# Altium schematic sheet Wedka_schemat.SchDoc
size A3; SheetNumber: 1; SheetTotal: 1
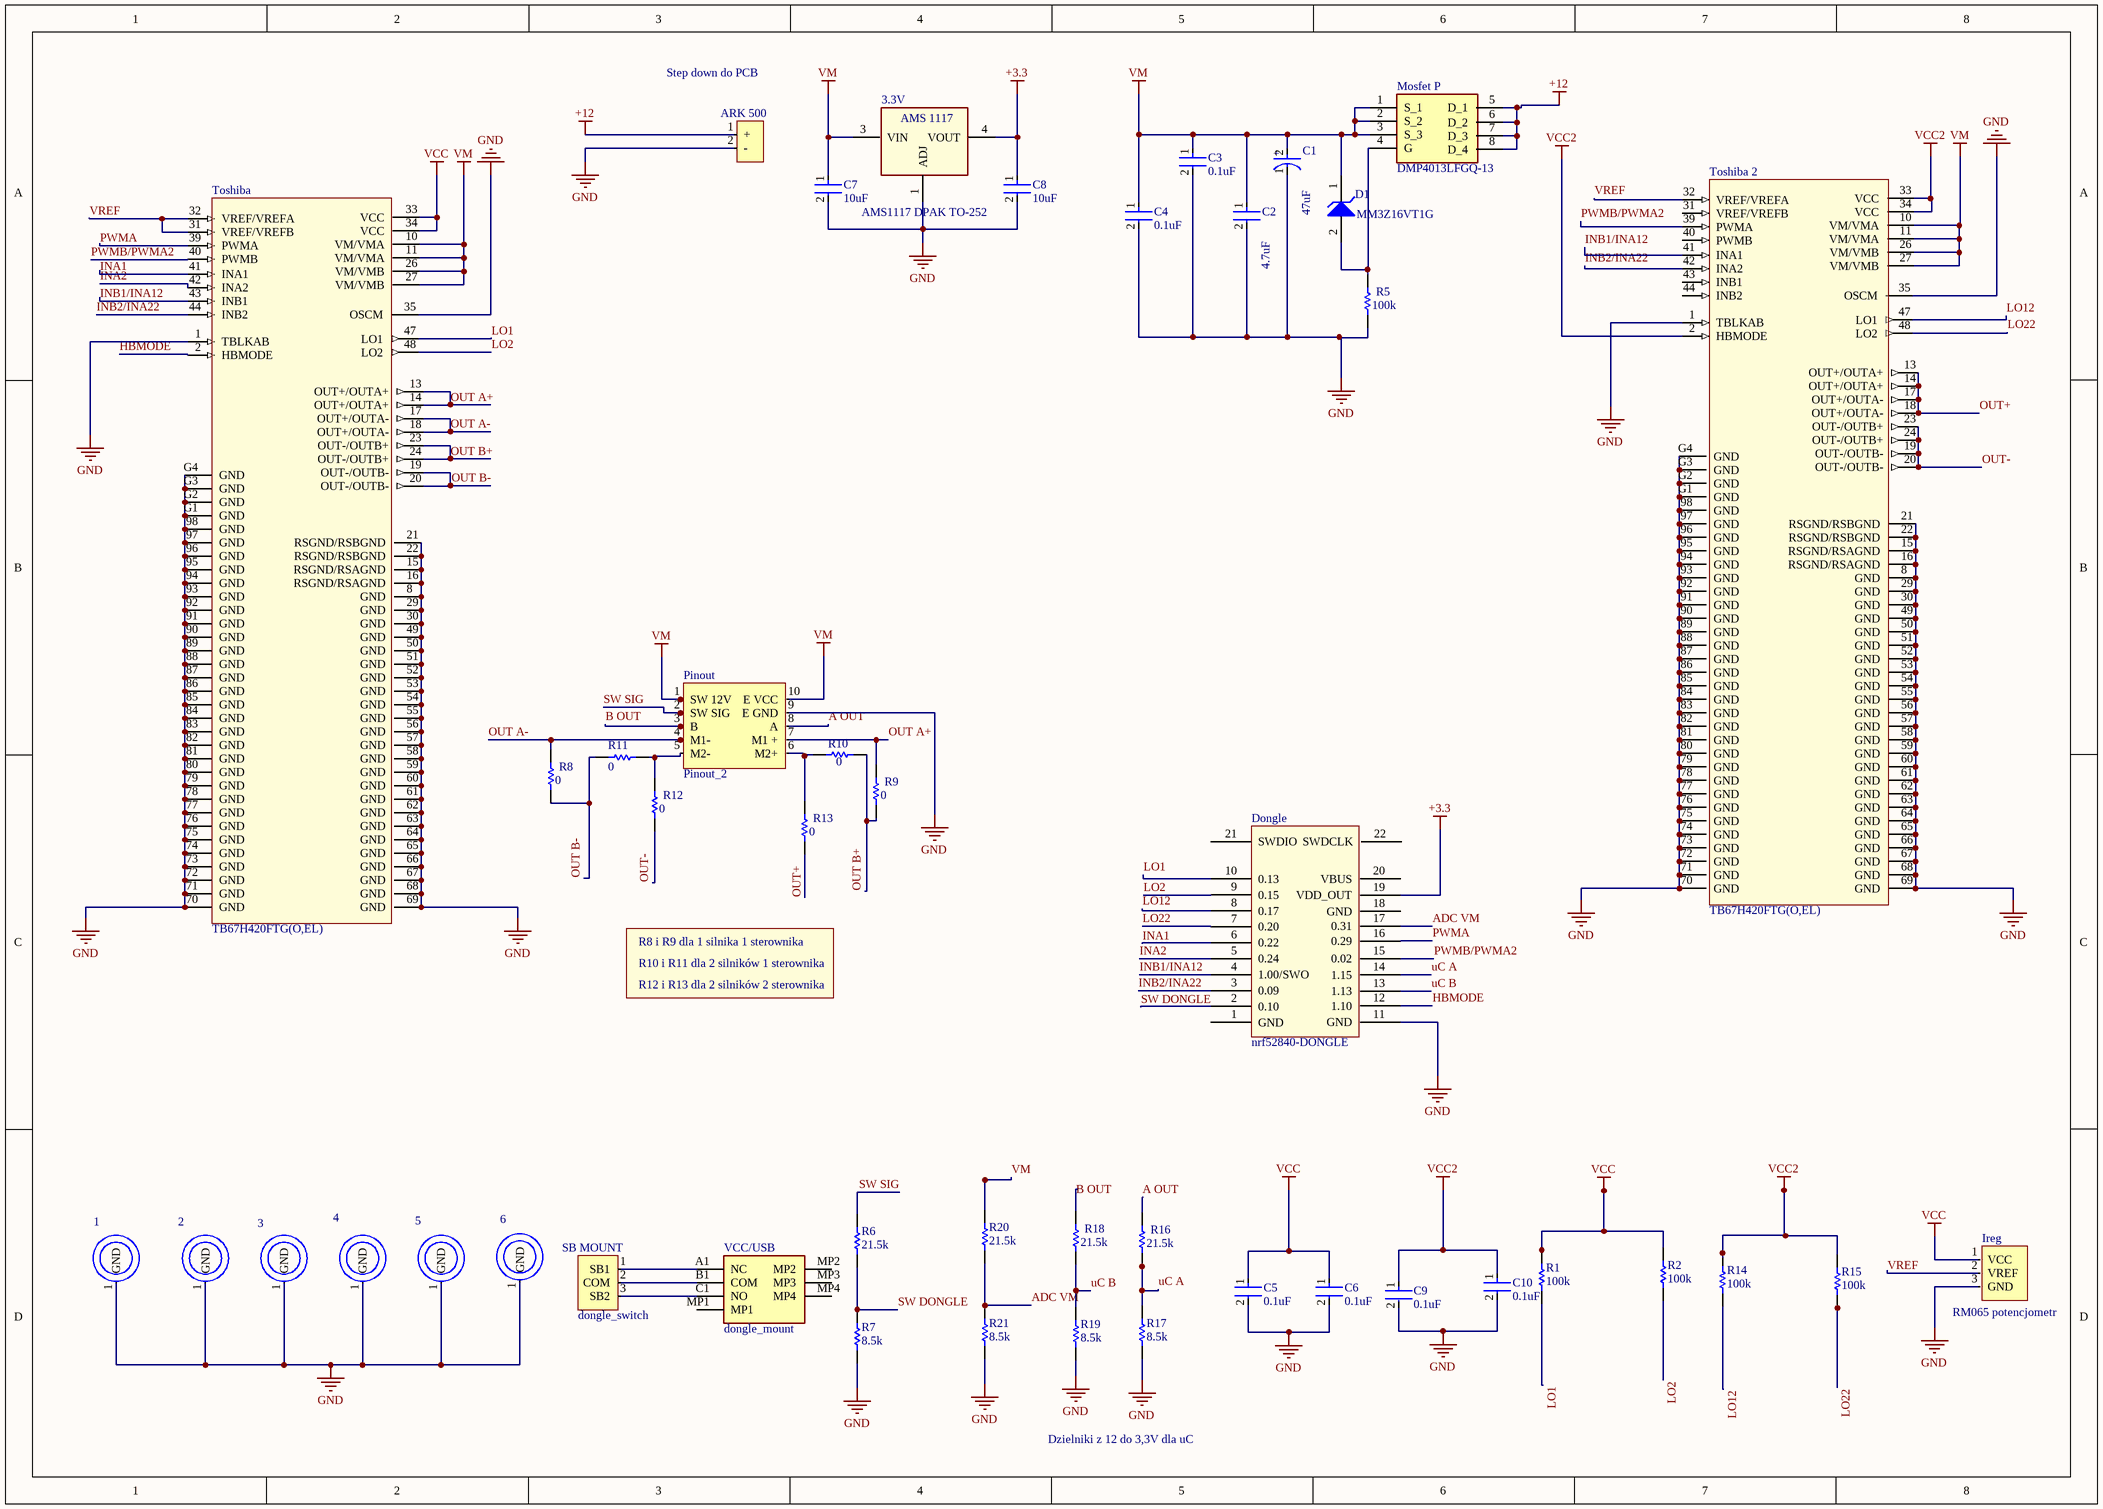
[diagram p0: Wedka_schemat.SchDoc]

## Parts
(Parts that share a designator on the sheet are numbered #1, #2 ... from top to bottom, then left to right.)
3.3V  AMS1117 DPAK TO-252  [AMS1117CD]
?#1  ARK 500  [AK 500]
?#2  6  [PTH]
?#3  1  [PTH]
?#4  2  [PTH]
?#5  3  [PTH]
?#6  4  [PTH]
?#7  5  [PTH]
C1  47uF  [FP-FTD-MFG]
C2  4.7uF  [FP-C0805C475K3PACTU-MFG]
C3  0.1uF  [FP-C0805C104M5UACTU-MFG]
C4  0.1uF  [FP-C0805C104M5UACTU-MFG]
C5  0.1uF  [FP-C0805C104M5UACTU-MFG]
C6  0.1uF  [FP-C0805C104M5UACTU-MFG]
C7  10uF  [FP-GRM21B-0_1-IPC_C]
C8  10uF  [FP-GRM21B-0_1-IPC_C]
C9  0.1uF  [FP-C0805C104M5UACTU-MFG]
C10  0.1uF  [FP-C0805C104M5UACTU-MFG]
D1  MM3Z16VT1G  [ONSC-SOD-323-2-477-02_V]
Dongle  nrf52840-DONGLE  [nrf52840]
Ireg  RM065 potencjometr  [Potenciometer]
Mosfet_P  DMP4013LFGQ-13  [DMP4013LFGQ-13]
Pinout  Pinout_2  [Pinout_2]
R1  100k  [RESC2013X60X35ML10T20]
R2  100k  [RESC2013X60X35ML10T20]
R5  100k  [RESC2013X60X35ML10T20]
R6  21.5k  [RESC2013X60X35ML10T20]
R7  8.5k  [RESC2013X60X35ML10T20]
R8  0  [RESC2013X60X35ML10T20]
R9  0  [RESC2013X60X35ML10T20]
R10  0  [RESC2013X60X35ML10T20]
R11  0  [RESC2013X60X35ML10T20]
R12  0  [RESC2013X60X35ML10T20]
R13  0  [RESC2013X60X35ML10T20]
R14  100k  [RESC2013X60X35ML10T20]
R15  100k  [RESC2013X60X35ML10T20]
R16  21.5k  [RESC2013X60X35ML10T20]
R17  8.5k  [RESC2013X60X35ML10T20]
R18  21.5k  [RESC2013X60X35ML10T20]
R19  8.5k  [RESC2013X60X35ML10T20]
R20  21.5k  [RESC2013X60X35ML10T20]
R21  8.5k  [RESC2013X60X35ML10T20]
SB_MOUNT  dongle_switch  [switch_dongle]
Toshiba  TB67H420FTG(O,EL)  [Toshiba]
Toshiba_2  TB67H420FTG(O,EL)  [Toshiba]
VCC/USB  dongle_mount  [dongle_mount]

## Nets
+3.3: 3.3V.4(VOUT) C8.1 Dongle.19(VDD_OUT)
+12: ?#1.1(+) Mosfet_P.5(D_1) Mosfet_P.6(D_2) Mosfet_P.7(D_3) Mosfet_P.8(D_4)
GND: 3.3V.1(ADJ) ?#1.2(-) ?#2.1(GND) ?#3.1(GND) ?#4.1(GND) ?#5.1(GND) ?#6.1(GND) ?#7.1(GND) C1.1(C) C2.2 C3.2 C4.2 C5.2 C6.2 C7.2 C8.2 C9.2 C10.2 Dongle.11(GND) Ireg.3(GND) Pinout.9(E_GND) R5.1 R7.1 R17.1 R19.1 R21.1 Toshiba.1(TBLKAB) Toshiba.8(GND) Toshiba.15(RSGND/RSAGND) Toshiba.16(RSGND/RSAGND) Toshiba.21(RSGND/RSBGND) Toshiba.22(RSGND/RSBGND) Toshiba.29(GND) Toshiba.30(GND) Toshiba.35(OSCM) Toshiba.49(GND) Toshiba.50(GND) Toshiba.51(GND) Toshiba.52(GND) Toshiba.53(GND) Toshiba.54(GND) Toshiba.55(GND) Toshiba.56(GND) Toshiba.57(GND) Toshiba.58(GND) Toshiba.59(GND) Toshiba.60(GND) Toshiba.61(GND) Toshiba.62(GND) Toshiba.63(GND) Toshiba.64(GND) Toshiba.65(GND) Toshiba.66(GND) Toshiba.67(GND) Toshiba.68(GND) Toshiba.69(GND) Toshiba.70(GND) Toshiba.71(GND) Toshiba.72(GND) Toshiba.73(GND) Toshiba.74(GND) Toshiba.75(GND) Toshiba.76(GND) Toshiba.77(GND) Toshiba.78(GND) Toshiba.79(GND) Toshiba.80(GND) Toshiba.81(GND) Toshiba.82(GND) Toshiba.83(GND) Toshiba.84(GND) Toshiba.85(GND) Toshiba.86(GND) Toshiba.87(GND) Toshiba.88(GND) Toshiba.89(GND) Toshiba.90(GND) Toshiba.91(GND) Toshiba.92(GND) Toshiba.93(GND) Toshiba.94(GND) Toshiba.95(GND) Toshiba.96(GND) Toshiba.97(GND) Toshiba.98(GND) Toshiba.G1(GND) Toshiba.G2(GND) Toshiba.G3(GND) Toshiba.G4(GND) Toshiba_2.1(TBLKAB) Toshiba_2.8(GND) Toshiba_2.15(RSGND/RSAGND) Toshiba_2.16(RSGND/RSAGND) Toshiba_2.21(RSGND/RSBGND) Toshiba_2.22(RSGND/RSBGND) Toshiba_2.29(GND) Toshiba_2.30(GND) Toshiba_2.35(OSCM) Toshiba_2.49(GND) Toshiba_2.50(GND) Toshiba_2.51(GND) Toshiba_2.52(GND) Toshiba_2.53(GND) Toshiba_2.54(GND) Toshiba_2.55(GND) Toshiba_2.56(GND) Toshiba_2.57(GND) Toshiba_2.58(GND) Toshiba_2.59(GND) Toshiba_2.60(GND) Toshiba_2.61(GND) Toshiba_2.62(GND) Toshiba_2.63(GND) Toshiba_2.64(GND) Toshiba_2.65(GND) Toshiba_2.66(GND) Toshiba_2.67(GND) Toshiba_2.68(GND) Toshiba_2.69(GND) Toshiba_2.70(GND) Toshiba_2.71(GND) Toshiba_2.72(GND) Toshiba_2.73(GND) Toshiba_2.74(GND) Toshiba_2.75(GND) Toshiba_2.76(GND) Toshiba_2.77(GND) Toshiba_2.78(GND) Toshiba_2.79(GND) Toshiba_2.80(GND) Toshiba_2.81(GND) Toshiba_2.82(GND) Toshiba_2.83(GND) Toshiba_2.84(GND) Toshiba_2.85(GND) Toshiba_2.86(GND) Toshiba_2.87(GND) Toshiba_2.88(GND) Toshiba_2.89(GND) Toshiba_2.90(GND) Toshiba_2.91(GND) Toshiba_2.92(GND) Toshiba_2.93(GND) Toshiba_2.94(GND) Toshiba_2.95(GND) Toshiba_2.96(GND) Toshiba_2.97(GND) Toshiba_2.98(GND) Toshiba_2.G1(GND) Toshiba_2.G2(GND) Toshiba_2.G3(GND) Toshiba_2.G4(GND)
VCC: C5.1 C6.1 Ireg.1(VCC) R1.2 R2.2 Toshiba.33(VCC) Toshiba.34(VCC)
VCC2: C9.1 C10.1 R14.2 R15.2 Toshiba_2.2(HBMODE) Toshiba_2.33(VCC) Toshiba_2.34(VCC)
VM: 3.3V.3(VIN) C1.2(A) C2.1 C3.1 C4.1 C7.1 D1.1(K) Mosfet_P.1(S_1) Mosfet_P.2(S_2) Mosfet_P.3(S_3) Pinout.1(SW_12V) Pinout.10(E_VCC) R20.2 Toshiba.10(VM/VMA) Toshiba.11(VM/VMA) Toshiba.26(VM/VMB) Toshiba.27(VM/VMB) Toshiba_2.10(VM/VMA) Toshiba_2.11(VM/VMA) Toshiba_2.26(VM/VMB) Toshiba_2.27(VM/VMB)
A OUT: Pinout.8(A) R16.2
ADC VM: Dongle.17(0.31) R20.1 R21.2
B OUT: Pinout.3(B) R18.2
HBMODE: Dongle.12(1.10) Toshiba.2(HBMODE)
INA1: Dongle.6(0.22) Toshiba.41(INA1)
INA2: Dongle.5(0.24) Toshiba.42(INA2)
INB1/INA12: Dongle.4(1.00/SWO) Toshiba.43(INB1) Toshiba_2.41(INA1)
INB2/INA22: Dongle.3(0.09) Toshiba.44(INB2) Toshiba_2.42(INA2)
LO1: Dongle.10(0.13) R1.1 Toshiba.47(LO1)
LO2: Dongle.9(0.15) R2.1 Toshiba.48(LO2)
LO12: Dongle.8(0.17) R14.1 Toshiba_2.47(LO1)
LO22: Dongle.7(0.20) R15.1 Toshiba_2.48(LO2)
OUT A+: Pinout.7(M1_+) R9.2 Toshiba.13(OUT+/OUTA+) Toshiba.14(OUT+/OUTA+)
OUT A-: Pinout.4(M1-) R8.2 Toshiba.17(OUT+/OUTA-) Toshiba.18(OUT+/OUTA-)
OUT B+: R9.1 R10.1 Toshiba.23(OUT-/OUTB+) Toshiba.24(OUT-/OUTB+)
OUT B-: R8.1 R11.2 Toshiba.19(OUT-/OUTB-) Toshiba.20(OUT-/OUTB-)
OUT+: R13.1 Toshiba_2.13(OUT+/OUTA+) Toshiba_2.14(OUT+/OUTA+) Toshiba_2.17(OUT+/OUTA-) Toshiba_2.18(OUT+/OUTA-)
OUT-: R12.1 Toshiba_2.19(OUT-/OUTB-) Toshiba_2.20(OUT-/OUTB-) Toshiba_2.23(OUT-/OUTB+) Toshiba_2.24(OUT-/OUTB+)
PWMA: Dongle.16(0.29) Toshiba.39(PWMA)
PWMB/PWMA2: Dongle.15(0.02) Toshiba.40(PWMB) Toshiba_2.39(PWMA)
SW DONGLE: Dongle.2(0.10) R6.1 R7.2
SW SIG: Pinout.2(SW_SIG) R6.2
uC A: Dongle.14(1.15) R16.1 R17.2
uC B: Dongle.13(1.13) R18.1 R19.2
VREF: Ireg.2(VREF) Toshiba.31(VREF/VREFB) Toshiba.32(VREF/VREFA) Toshiba_2.32(VREF/VREFA)
NetD1_2: D1.2(A) Mosfet_P.4(G) R5.2
NetPinout_5: Pinout.5(M2-) R11.1 R12.2
NetPinout_6: Pinout.6(M2+) R10.2 R13.2
NetSB_MOUNT_1: SB_MOUNT.1(SB1) VCC/USB.A1(NC)
NetSB_MOUNT_2: SB_MOUNT.2(COM) VCC/USB.B1(COM)
NetSB_MOUNT_3: SB_MOUNT.3(SB2) VCC/USB.C1(NO)

Not connected (* = marked no-connect by the designer): Dongle 1(GND) 18(GND) 20(VBUS) 21(SWDIO) 22(SWDCLK); Toshiba_2 31(VREF/VREFB) 40(PWMB) 43(INB1) 44(INB2); VCC/USB MP1 MP2 MP3 MP4

## Notes on the sheet
- Step down do PCB
- R8 i R9 dla 1 silnika 1 sterownika
- R10 i R11 dla 2 silników 1 sterownika
- R12 i R13 dla 2 silników 2 sterownika
- Dzielniki z 12 do 3,3V dla uC
- (in symbol AMS1117 DPAK) AMS 1117
- (in symbol CMP-05427-000060-1) +

## Library data of the parts
3.3V = AMS1117 DPAK
?#2-?#7 = PTH
C1 = CMP-05427-000060-1: CAP ALUM 47UF 20% 50V SMD; ESR (Equivalent Series Resistance): 680mR; Ripple Current (AC): 195mA; Dielectric Material: Aluminium; Leakage Current: 23.5uA; Life (Hours): 2000Hour; Lead Diameter: 0.65mm; Lead Pitch: 1.8mm; Voltage: 50V; Min Operating Temperature: -55°C; Capacitance: 47uF; Radiation Hardening: No; Series: FT; Contact Plating: Tin; Mount: Surface Mount; REACH SVHC: No SVHC; RoHS Compliant: Yes; Package Quantity: 1; Tolerance: 20%; Construction: Cylindrical; Max Operating Temperature: 105°C; Packaging: Tape and Reel; Length: 5.8mm; Number of Pins: 2; Diameter: 6.3mm; Voltage Rating (DC): 50V; Voltage Rating: 50V; Height - Seated (Max): 0.24inch; Height: 5.8mm; Lead Free: Lead Free; Case/Package: Radial; Ripple Current: 195mA; Termination: SMD/SMT
C2 = CMP-2007-01010-2: CAP CER 4.7UF 25V X5R 0805; Tolerance: 10%; Dielectric Material: Ceramic; Dissipation Factor: 5%; Length: 2mm; Number of Pins: 2; Voltage Rating (DC): 25V; Depth: 1.25mm; Min Operating Temperature: -55°C; Capacitance: 4.7uF; Series: C0805C; Lead Free: Lead Free; Dielectric: X5R; REACH SVHC: No SVHC; Termination: SMD/SMT; Mount: PCB; Package Quantity: 2500; Contact Plating: Tin; Case Code (Imperial): 0805; Max Operating Temperature: 85°C; Width: 1.2mm; Voltage: 25V; Case/Package: 0805; Packaging: Tape and Reel; Height: 1.25mm; RoHS Compliant: Yes; Construction: Flat; Case Code (Metric): 2012; Radiation Hardening: No
C3-C6 C9 C10 = CMP-2007-03742-2: CAP CER 0.1UF 50V Z5U 0805; Dielectric Material: Ceramic; Tolerance: 20%; Dissipation Factor: 4%; Capacitance: 100nF; Height: 0.78mm; Dielectric: Z5U; REACH SVHC: No SVHC; Min Operating Temperature: 10°C; Lead Pitch: 0.75mm; Construction: Flat; Mount: Surface Mount; Max Operating Temperature: 85°C; RoHS Compliant: Yes; Width: 1.2mm; Contact Plating: Tin; Thickness: 0.035inch; Series: C; Packaging: Tape and Reel; Package Quantity: 1; Voltage Rating (DC): 50V; Termination: SMD/SMT; Voltage: 50V; Case Code (Metric): 2012; Depth: 1.25mm; Radiation Hardening: No; Case/Package: 0805; Length: 2mm; Case Code (Imperial): 0805; Voltage Rating: 50V; Number of Pins: 2; Lead Free: Lead Free
C7 C8 = CMP-2007-03453-2: Chip Multilayer Ceramic Capacitors for General Purpose, 0805, 10uF, X5R, 15%, 10%, 16V; Radiation Hardening: No; Thickness: 0.053inch; Voltage Rating (DC): 16V; Lead Free: Lead Free; Package Quantity: 1; Width: 1.25mm; Case Code (Imperial): 0805; Depth: 1.25mm; Packaging: Tape and Reel; Dielectric: X5R; Max Operating Temperature: 85°C; Tolerance: 10%; Voltage Rating: 16V; Voltage: 16V; Capacitance: 10uF; Height: 1.25mm; Case Code (Metric): 2012; Material: Ceramic; Mount: Surface Mount; Case/Package: 0805; REACH SVHC: No SVHC; Length: 2mm; Min Operating Temperature: -55°C; Termination: SMD/SMT
D1 = CMP-1060-00709-1: Zener Voltage Regulator, 300 mW, 2-Pin SOD-323, Pb-Free, Tape and Reel; Manufacturer: On Semiconductor; VZ Typ (V): 16.2; P Max (W): 0.3; ComponentLink3URL: http://www.onsemi.com/pub_link/Collateral/477-02.PDF.1; ComponentLink1Description: Manufacturer URL; PackageReference: SOD-323-2-477-02; PackageVersion: Rev. H, 03/2007; Packing: Tape and Reel; PackageDescription: 2-Pin SOD, Body 1.7 x 1.25 mm; ComponentLink2URL: http://www.onsemi.cn/pub_link/Collateral/MM3Z2V4T1-D.PDF; ComponentLink3Description: Package Specification; DatasheetVersion: Rev. 9; ComponentLink1URL: http://www.onsemi.com/; RoHS: Pb-Free; Mounting Technology: Surface Mount; PartNumber: MM3Z16VT1G; ComponentLink2Description: Datasheet
R1 R2 R5-R21 = CMP-2100-03673-1: Chip Resistor, 0 Ohm, Jumper, +/- 5%, 0.125 W, -55 to 155 degC, 0805 (2012 Metric), RoHS, Tape and Reel; Manufacturer: Yageo; Power Rating: 125mW; Resistance: 0mOhm; Voltage Rating (DC): 150V; Temperature Coefficient: 200ppm/degreesC; Height: 0.5mm; Depth: 1.25mm; Case Code (Imperial): 0805; Lead Free: LeadFree; Military Standard: Not; Package Description: 2-Pin Surface Mounted Device, Body 2 x 1.25 mm; Case Code (Metric): 2012; Composition: ThickFilm; Voltage Rating: 150V; Manufacturer URL: http://www.yageo.com/; Packaging: TapeandReel; Package Reference: 0805; REACH SVHC: Unknown; Tolerance: 5%; Case/Package: 0805; Max Operating Temperature: 155degC; Number of Pins: 2; Min Operating Temperature: -55degC; RoHSCompliant: true; Length: 2mm; Datasheet URL: http://www.yageo.com/NewPortal/yageodocoutput?fileName=/pdf/R-Chip/PYu-RC_Group_51_RoHS_L_5.pdf; Termination: SMD/SMT; Radiation Hardening: No; Width: 1.25mm; Contact Plating: Tin; Datasheet Version: Rev. 5, 10/2016
Toshiba Toshiba_2 = TB67H420FTG(O,EL): Bipolar Motor Driver CMOS PWM 48-QFN _7x7_; MP: TB67H420FTG_O,EL_; SnapEDA_Link: https://www.snapeda.com/parts/TB67H420FTG%28O%2CEL%29/avi/view-part/4448976/?ref=snap; Availability: Unavailable; Value: *; Price: None; MF: Toshiba; Package: None